# EAGLE design Sparkman v2 (EAGLE 6.1)
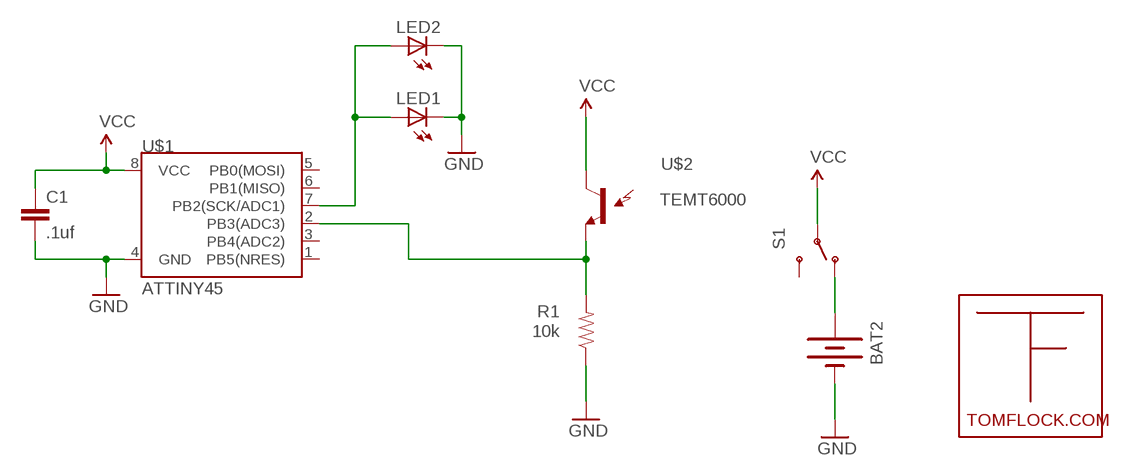
[diagram p0: schematic, sheet 1]

## Parts
BAT2  BATTERY12MM  [BATTCON_12MM]
C1  .1uf  CAP0603-CAP  [0603-CAP]
LED1  LED0603  [LED-0603]
LED2  LED0603  [LED-0603]
R1  10k  RESISTOR0603-RES  [0603-RES]
S1  SWITCH-SPSTSMD  [AYZ0202]
U$1  ATTINY45  [SO08-EIAJ]
U$2  TEMT6000  [TEMT6000-SEN]
U$3  TFLOGO  [TFLOGO]

## Nets
GND: BAT2.GND(-) C1.2 LED1.C LED2.C R1.1 U$1.4(GND)
N$1: LED1.A LED2.A U$1.7(PB2(SCK/ADC1))
N$2: R1.2 U$1.2(PB3(ADC3)) U$2.EMITTER(E1)
N$3: BAT2.PWR@1(+) S1.1(O)
VCC: C1.1 S1.2(P) U$1.8(VCC) U$2.COLLECTOR(C1)
Unconnected: S1.3(S) U$1.1(PB5(NRES)) U$1.3(PB4(ADC2)) U$1.5(PB0(MOSI)) U$1.6(PB1(MISO))

## Library data of the parts
BAT2 = SparkFun:BATTERY: Battery Holders Various common sizes : AA, AAA, 20mm coin cell and 12mm coin cell.
C1 = SparkFun:CAP: Capacitor Standard 0603 ceramic capacitor, and 0.1" leaded capacitor.
LED1 LED2 = SparkFun:LED: LEDs Standard schematic elements and footprints for 5mm, 3mm, 1206, and 0603 sized LEDs. 5mm - Spark Fun Electronics SKU : COM-00529 (and others)
R1 = SparkFun:RESISTOR: Resistor Basic schematic elements and footprints for 0603, 1206, and PTH resistors.
S1 = SparkFun:SWITCH-SPST: SPST Switch Simple slide switch. Spark Fun Electronics SKU : COM-00102
U$1 = SparkFun:ATTINY45: Atmel ATTiny45
U$2 = SparkFun:TEMT6000: Ambient Light Sensor Simple light detection sensor. Output varies with light intensity input. Spark Fun Electronics SKU : COM-08348
U$3 = TOM1:TFLOGO

## Board
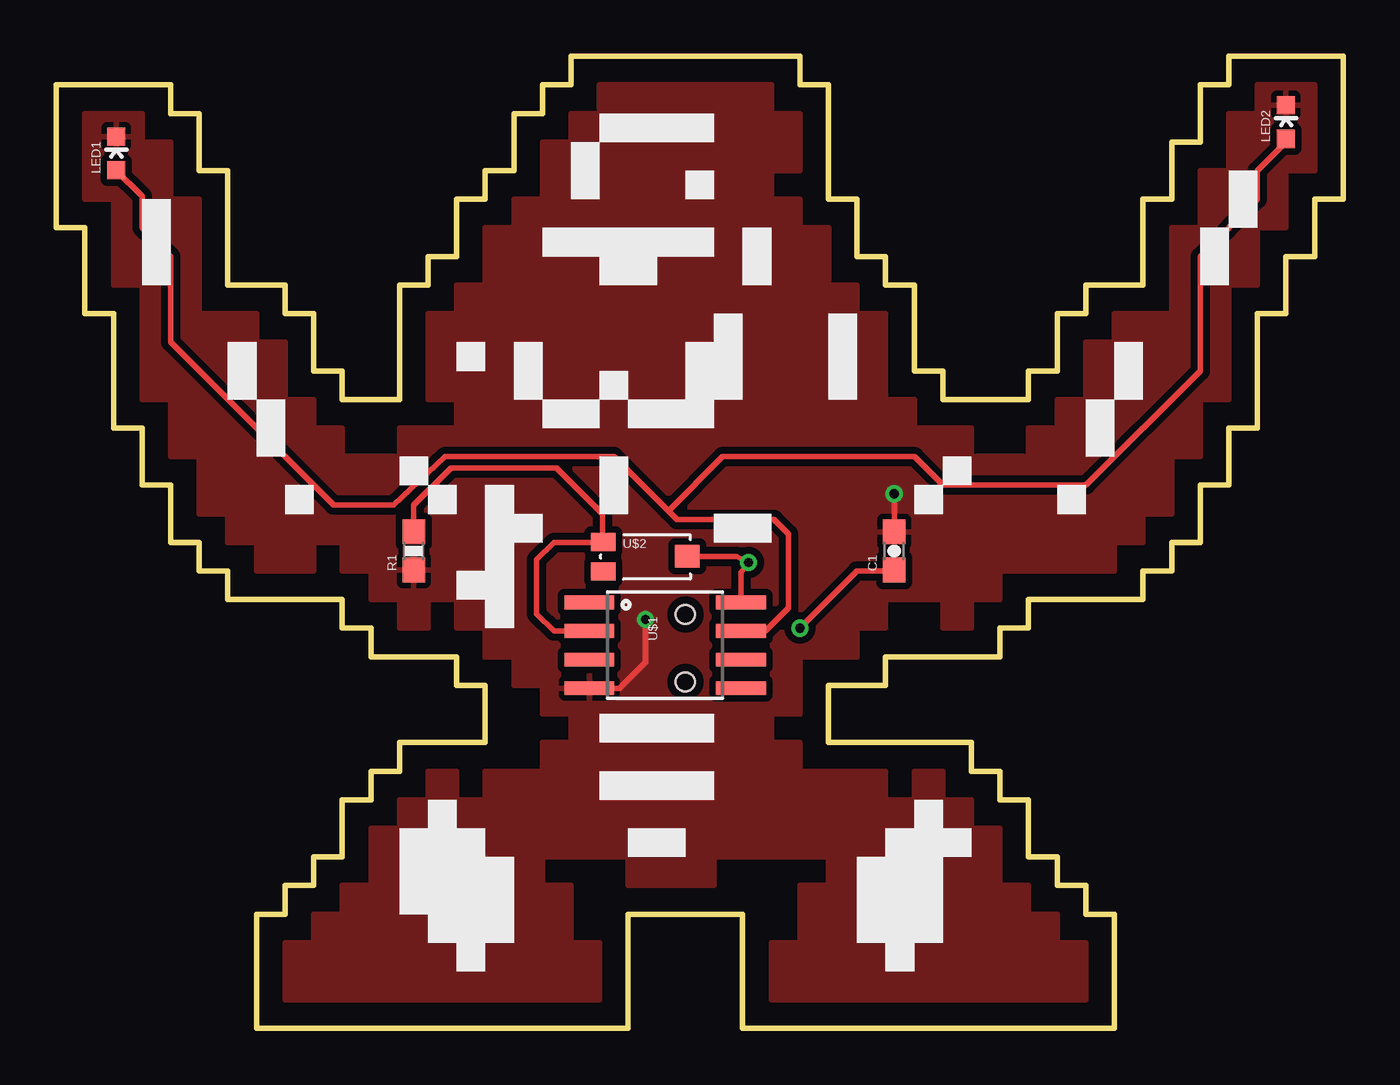
[diagram p1: board, top side]
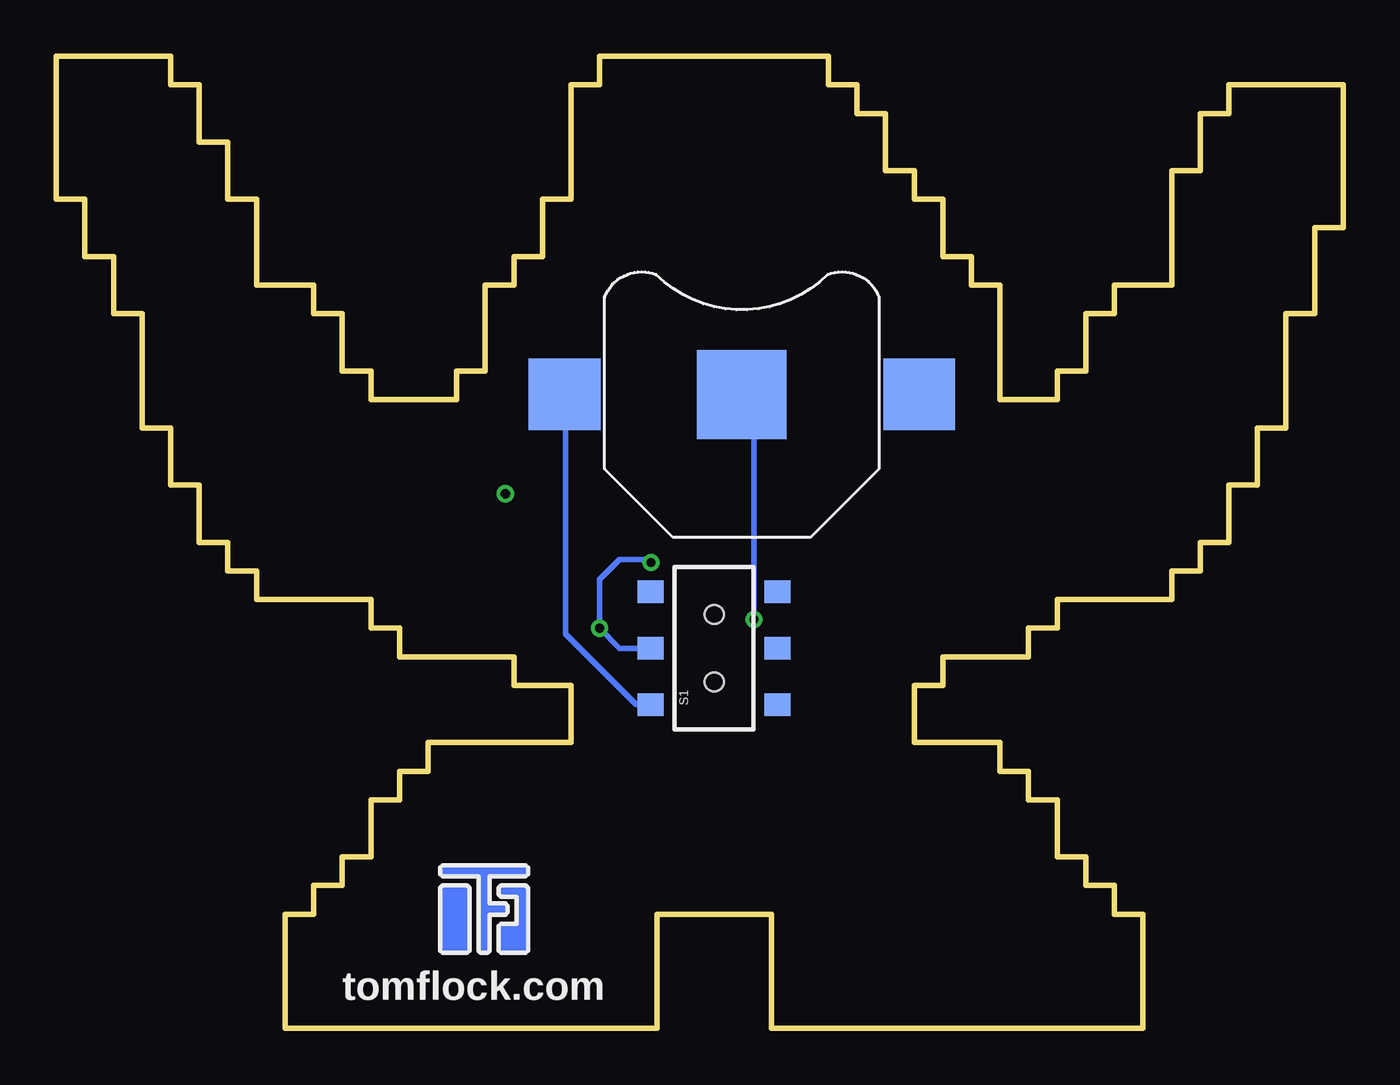
[diagram p2: board, bottom side, seen from below]

Size 57.15 x 43.18 mm. Coordinates in mm from the lower left corner, seen from the top.
Outline: 8.89,0 8.89,5.08 10.16,5.08 10.16,6.35 11.43,6.35 11.43,7.62 12.7,7.62 12.7,10.16 13.97,10.16 13.97,11.43 15.24,11.43 15.24,12.7 19.05,12.7 19.05,15.24 17.78,15.24 17.78,16.51 13.97,16.51 13.97,17.78 12.7,17.78 12.7,19.05 7.62,19.05 7.62,20.32 6.35,20.32 6.35,21.59 5.08,21.59 5.08,24.13 3.81,24.13 3.81,26.67 2.54,26.67 2.54,31.75 1.27,31.75 1.27,35.56 0,35.56 0,41.91 5.08,41.91 5.08,40.64 6.35,40.64 6.35,38.1 7.62,38.1 7.62,33.02 10.16,33.02 10.16,31.75 11.43,31.75 11.43,29.21 12.7,29.21 12.7,27.94 15.24,27.94 15.24,33.02 16.51,33.02 16.51,34.29 17.78,34.29 17.78,36.83 19.05,36.83 19.05,38.1 20.32,38.1 20.32,40.64 21.59,40.64 21.59,41.91 22.86,41.91 22.86,43.18 33.02,43.18 33.02,41.91 34.29,41.91 34.29,36.83 35.56,36.83 35.56,34.29 36.83,34.29 36.83,33.02 38.1,33.02 38.1,29.21 39.37,29.21 39.37,27.94 43.18,27.94 43.18,29.21 44.45,29.21 44.45,31.75 45.72,31.75 45.72,33.02 48.26,33.02 48.26,36.83 49.53,36.83 49.53,39.37 50.8,39.37 50.8,41.91 52.07,41.91 52.07,43.18 57.15,43.18 57.15,36.83 55.88,36.83 55.88,34.29 54.61,34.29 54.61,31.75 53.34,31.75 53.34,26.67 52.07,26.67 52.07,24.13 50.8,24.13 50.8,21.59 49.53,21.59 49.53,20.32 48.26,20.32 48.26,19.05 43.18,19.05 43.18,17.78 41.91,17.78 41.91,16.51 36.83,16.51 36.83,15.24 34.29,15.24 34.29,12.7 40.64,12.7 40.64,11.43 41.91,11.43 41.91,10.16 43.18,10.16 43.18,7.62 44.45,7.62 44.45,6.35 45.72,6.35 45.72,5.08 46.99,5.08 46.99,0 30.48,0 30.48,5.08 25.4,5.08 25.4,0 8.89,0
Copper layers (1*16): Top 0.0356mm / dielectric 1.5011mm / Bottom 0.0356mm
Design rules: minimum track width 6mil, minimum drill 13mil, track to track 6mil, track to pad 6mil, pad to pad 6mil, via to via 6mil, smd to smd 6mil, copper to edge 15mil, drill to drill 6mil, minimum pad ring 7mil, minimum via ring 7mil, stop-mask expansion 4mil, vias tented up to drill 0mil, thermal gap 10mil

### Footprints (pad centres in the part's own frame; a part is rotated, then mirrored left to right if it is on the bottom)
BATTCON_12MM = smd 3.962 x 3.962: GND 0,0 | smd 3.175 x 3.175: PWR@1 -7.874,0; PWR@2 7.874,0
0603-CAP = smd 1.1 x 1: 1 -0.85,0; 2 0.85,0
LED-0603 = smd 0.8 x 0.8: A 0,-0.75; C 0,0.75
0603-RES = smd 1.1 x 1: 1 -0.85,0; 2 0.85,0
AYZ0202 = smd 1 x 1.15: 1 -2.5,2.825; 2 0,2.825; 3 2.5,2.825; 4 -2.5,-2.825; 5 0,-2.825; 6 2.5,-2.825 | hole 0.85: 1.5,0; -1.5,0
SO08-EIAJ = smd 0.61 x 2.21: 1 -1.905,-3.378; 2 -0.635,-3.378; 3 0.635,-3.378; 4 1.905,-3.378; 5 1.905,3.353; 6 0.635,3.353; 7 -0.635,3.353; 8 -1.905,3.353
TEMT6000-SEN = smd 1.1 x 0.8: BASE -1.87,-0.65; EMITTER -1.87,0.65 | smd 1.1 x 1: COLLECTOR 1.86,0.01

### Placement (x,y rotation side)
BAT2  26.7,28.16 0 bottom
C1  37.21,21.21 90 top
LED1  2.67,38.86 0 top
LED2  54.61,40.26 0 top
R1  15.88,21.21 90 top
S1  27.94,16.89 90 bottom
U$1  27.05,17.02 270 top
U$2  26.16,20.95 0 top
U$3  38.1,4.95 0 bottom

### Tracks (layer width: path | path; a pad name or v marks a point on that pad's centre or on a via)
GND  (via drill 0.41)
  Top 0.254: v37.21,23.75 C1.2 | U$1.4 25.02,15.11 26.16,16.26 v26.16,18.16
  Bottom 0.254: v26.16,18.16 26.16,27.62 BAT2.GND
  pour Top (isolate 0.305): 39.37,17.78 40.64,17.78 40.64,19.05 41.91,19.05 41.91,20.32 46.99,20.32 46.99,21.59 48.26,21.59 48.26,22.86 49.53,22.86 49.53,25.4 50.8,25.4 50.8,27.94 52.07,27.94 52.07,33.02 53.34,33.02 53.34,35.56 54.61,35.56 54.61,38.1 55.88,38.1 55.88,41.91 53.34,41.91 53.34,40.64 52.07,40.64 52.07,38.1 50.8,38.1 50.8,35.56 49.53,35.56 49.53,31.75 46.99,31.75 46.99,30.48 45.72,30.48 45.72,27.94 44.45,27.94 44.45,26.67 43.18,26.67 43.18,25.4 40.64,25.4 40.64,26.67 38.1,26.67 38.1,27.94 36.83,27.94 36.83,31.75 35.56,31.75 35.56,33.02 34.29,33.02 34.29,35.56 33.02,35.56 33.02,36.83 31.75,36.83 31.75,38.1 33.02,38.1 33.02,40.64 31.75,40.64 31.75,41.91 24.13,41.91 24.13,40.64 22.86,40.64 22.86,39.37 21.59,39.37 21.59,36.83 20.32,36.83 20.32,35.56 19.05,35.56 19.05,33.02 17.78,33.02 17.78,31.75 16.51,31.75 16.51,27.94 17.78,27.94 17.78,26.67 15.24,26.67 15.24,25.4 12.7,25.4 12.7,26.67 11.43,26.67 11.43,27.94 10.16,27.94 10.16,30.48 8.89,30.48 8.89,31.75 6.35,31.75 6.35,36.83 5.08,36.83 5.08,39.37 3.81,39.37 3.81,40.64 1.27,40.64 1.27,36.83 2.54,36.83 2.54,33.02 3.81,33.02 3.81,27.94 5.08,27.94 5.08,25.4 6.35,25.4 6.35,22.86 7.62,22.86 7.62,21.59 8.89,21.59 8.89,20.32 11.43,20.32 11.43,21.59 12.7,21.59 12.7,20.32 13.97,20.32 13.97,19.05 15.24,19.05 15.24,17.78 16.51,17.78 16.51,19.05 17.78,19.05 17.78,17.78 19.05,17.78 19.05,16.51 20.32,16.51 20.32,15.24 21.59,15.24 21.59,13.97 22.86,13.97 22.86,12.7 21.59,12.7 21.59,11.43 19.05,11.43 19.05,10.16 17.78,10.16 17.78,11.43 16.51,11.43 16.51,10.16 15.24,10.16 15.24,8.89 13.97,8.89 13.97,6.35 12.7,6.35 12.7,5.08 11.43,5.08 11.43,3.81 10.16,3.81 10.16,1.27 24.13,1.27 24.13,3.81 22.86,3.81 22.86,6.35 21.59,6.35 21.59,7.62 25.4,7.62 25.4,6.35 29.21,6.35 29.21,7.62 34.29,7.62 34.29,6.35 33.02,6.35 33.02,3.81 31.75,3.81 31.75,1.27 45.72,1.27 45.72,3.81 44.45,3.81 44.45,5.08 43.18,5.08 43.18,6.35 41.91,6.35 41.91,8.89 40.64,8.89 40.64,10.16 39.37,10.16 39.37,11.43 38.1,11.43 38.1,10.16 36.83,10.16 36.83,11.43 33.02,11.43 33.02,12.7 31.75,12.7 31.75,13.97 33.02,13.97 33.02,16.51 35.56,16.51 35.56,17.78 36.83,17.78 36.83,19.05 39.37,19.05
N$1
  Top 0.254: LED1.A 3.81,36.96 3.81,35.56 5.08,34.29 5.08,30.48 12.32,23.24 14.99,23.24 17.27,25.4 24.77,25.4 27.18,22.99 | LED2.A 54.61,39.37 53.34,38.1 53.34,36.83 50.8,34.29 50.8,29.21 45.72,24.13 39.37,24.13 38.1,25.4 29.59,25.4 27.18,22.99 | U$1.7 31.5,17.65 32.51,18.67 32.51,21.97 31.88,22.61 27.56,22.61 27.18,22.99
N$2
  Top 0.254: R1.2 15.88,23.24 17.53,24.89 22.22,24.89 24.26,22.86 24.26,21.64 U$2.EMITTER 24.28,21.59 22.1,21.59 21.34,20.83 21.34,18.41 22.1,17.65 U$1.2
N$3
  Bottom 0.254: S1.1 31.41,14.39 34.54,17.53 34.54,28.12 BAT2.PWR@1
VCC  (via drill 0.41)
  Top 0.254: U$2.COLLECTOR 30.22,20.96 v30.73,20.7 30.4,20.24 U$1.8 | C1.1 37.17,20.32 35.56,20.32 v33.02,17.78
  Bottom 0.254: S1.2 32.13,16.89 v33.02,17.78 33.02,19.94 32.13,20.83 30.86,20.83 v30.73,20.7

### Text on the board
bPlace: tomflock.com